# Altium schematic sheet 7c - FET Controls.SchDoc
size A4
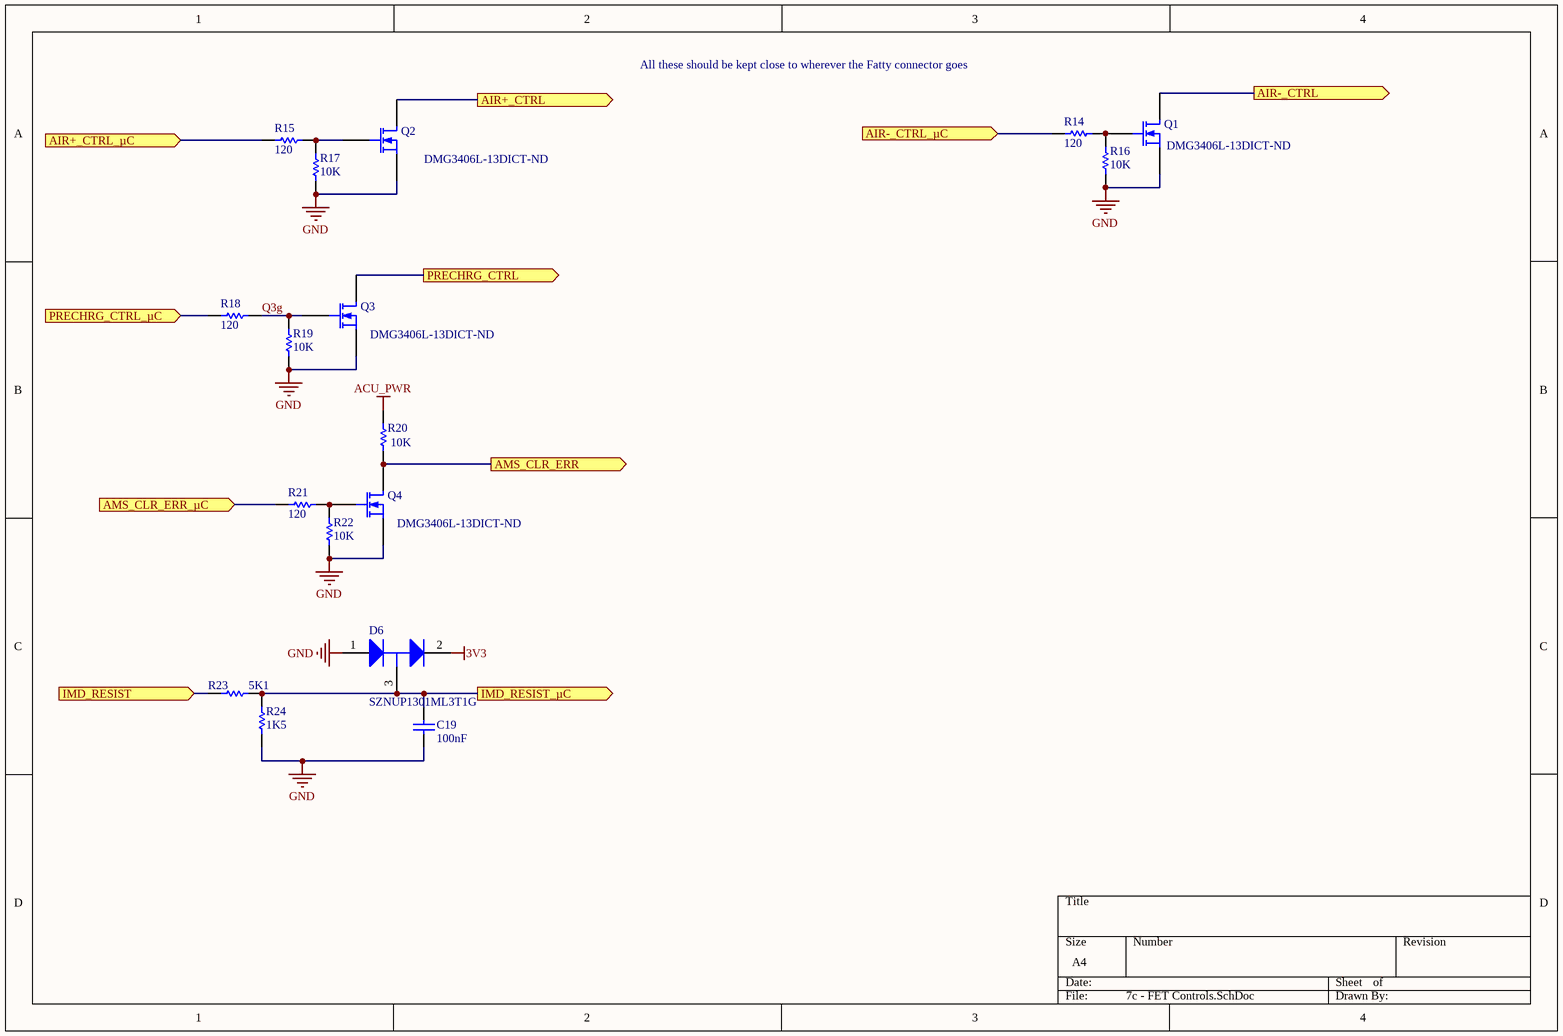
[diagram p0: 7c - FET Controls.SchDoc]

## Parts
C19  value 100nF  [1608[0603]]  (hidden comment: Cap)
D6  SZNUP1301ML3T1G  [ONSC-SOT-23-3-318-08_V]
Q1  Supplier Part Number 1: DMG3406L-13DICT-ND  [SOT-23_N]
Q2  Supplier Part Number 1: DMG3406L-13DICT-ND  [SOT-23_N]
Q3  Supplier Part Number 1: DMG3406L-13DICT-ND  [SOT-23_N]
Q4  Supplier Part Number 1: DMG3406L-13DICT-ND  [SOT-23_N]
R14  120  [1608[0603]]
R15  120  [1608[0603]]
R16  10K  [1608[0603]]
R17  10K  [1608[0603]]
R18  120  [1608[0603]]
R19  10K  [1608[0603]]
R20  10K  [1608[0603]]
R21  120  [1608[0603]]
R22  10K  [1608[0603]]
R23  value 5K1  [1608[0603]]  (hidden comment: Res1)
R24  value 1K5  [1608[0603]]  (hidden comment: Res1)

## Ports
AIR+_CTRL (out), AIR+_CTRL_µC (in), AIR-_CTRL (out), AIR-_CTRL_µC (in), AMS_CLR_ERR (out), AMS_CLR_ERR_µC (in), IMD_RESIST (in), IMD_RESIST_µC (out), PRECHRG_CTRL (out), PRECHRG_CTRL_µC (in)

## Nets
3V3: D6.2(K)
ACU_PWR: R20.2
GND: C19.1 D6.1(A) Q1.2(S) Q2.2(S) Q3.2(S) Q4.2(S) R16.1 R17.1 R19.1 R22.1 R24.1
AIR+_CTRL: Q2.3(D) ; port AIR+_CTRL
AIR+_CTRL_µC: R15.1 ; port AIR+_CTRL_µC
AIR-_CTRL: Q1.3(D) ; port AIR-_CTRL
AIR-_CTRL_µC: R14.1 ; port AIR-_CTRL_µC
AMS_CLR_ERR: Q4.3(D) R20.1 ; port AMS_CLR_ERR
AMS_CLR_ERR_µC: R21.1 ; port AMS_CLR_ERR_µC
IMD_RESIST: R23.1 ; port IMD_RESIST
IMD_RESIST_µC: C19.2 D6.3(K/A) R23.2 R24.2 ; port IMD_RESIST_µC
PRECHRG_CTRL: Q3.3(D) ; port PRECHRG_CTRL
PRECHRG_CTRL_µC: R18.1 ; port PRECHRG_CTRL_µC
Q3g: Q3.1(G) R18.2 R19.2
NetQ1_1: Q1.1(G) R14.2 R16.2
NetQ2_1: Q2.1(G) R15.2 R17.2
NetQ4_1: Q4.1(G) R21.2 R22.2

## Notes on the sheet
- All these should be kept close to wherever the Fatty connector goes

## Library data of the parts
C19 = Cap: Capacitor; Published: 8-Jun-2000; LatestRevisionDate: 17-Jul-2002; LatestRevisionNote: Re-released for DXP Platform.; PackageReference: RAD-0.3; Publisher: Altium Limited; PackageDescription: Radial Cap, Thru-Hole; 2 Leads; 0.3 in Pin Spacing
D6 = CMP-1063-00171-1: Low Capacitance Diode Array for ESD Protection in a Single Data Line, 3-Pin SOT-23, Pb-Free, Tape and Reel; Manufacturer: On Semiconductor; C Max (pF): 0.9; Direction: Bidirectional; V(BR) Min (V): 70; Number of Lines: 1; Mounting Technology: Surface Mount; PackageReference: SOT-23-3-318-08; DatasheetVersion: Rev. 6; PackageVersion: Rev. AP, 11/2009; RoHS: Pb-Free; ComponentLink1Description: Manufacturer URL; ComponentLink1URL: http://www.onsemi.com/; PackageDescription: 3-Pin Small Outline Transistor, Body 2.92 x 1.3 mm, Pitch 0.95 mm; PartNumber: SZNUP1301ML3T1G; Packing: Tape and Reel; ComponentLink3URL: http://www.onsemi.cn/pub_link/Collateral/318-08.PDF; ComponentLink3Description: Package Specification; VRWM Max (V): 70; ComponentLink2Description: Datasheet; ComponentLink2URL: http://www.onsemi.cn/pub_link/Collateral/NUP1301ML3T1-D.PDF
Q1-Q4 = MOSFET-N: N-Channel MOSFET; Manufacturer: Infineon Technologies; Manufacturer Part Number: IPD075N03L G; FET Type: MOSFET N-Channel, Metal Oxide; FET Feature: Logic Level Gate; Drain to Source Voltage (Vdss): 30V; Current - Continuous Drain (Id) @ 25°C: 50A (Tc); Rds On (Max) @ Id, Vgs: 7.5 mOhm @ 30A, 10V; Vgs(th) (Max) @ Id: 2.2V @ 250µA; Gate Charge (Qg) @ Vgs: 18nC @ 10V; Input Capacitance (Ciss) @ Vds: 1900pF @ 15V; Power - Max: 47W; Published: 8-Jun-2000; LatestRevisionDate: 17-Jul-2002; LatestRevisionNote: Re-released for DXP Platform.; PackageVersion: 1995/1996; PackageReference: E3; Publisher: Altium Limited; PackageDescription: TO, Flat Index; 3 In-Line, Axial Leads; Body Dia. 4.6mm; Lead Dia. 0.5 mm (max); RoHS: RoHS Compliant; Category: Discrete Semiconductor Products; Packaging: Cut Tape (CT); Mounting Type: Surface Mount; Package / Case: TO-252-3, DPak (2 Leads + Tab), SC-63; Supplier Device Package: PG-TO252-3; ComponentLink1URL: http://www.infineon.com/dgdl/Infineon-IPD075N03LG-DS-v02_01-en.pdf?folderId=5546d4694909da4801490a07012f053b&fileId=db3a30431936bc4b011951d824f83aeb; ComponentLink1Description: http://www.infineon.com/dgdl/Infineon-IPD075N03LG-DS-v02_01-en.pdf?folderId=5546d4694909da4801490a07012f053b&fileId=db3a30431936bc4b011951d824f83aeb; ComponentLink2URL: http://www.semicon.toshiba.co.jp/info/docget.jsp?type=datasheet&lang=en&pid=SSM3K329R; ComponentLink2Description: http://www.semicon.toshiba.co.jp/info/docget.jsp?type=datasheet&lang=en&pid=SSM3K329R; Supplier 1: Digi-Key
R14-R22 = Res1: Resistor; Value: 1K; Published: 8-Jun-2000; LatestRevisionDate: 17-Jul-2002; LatestRevisionNote: Re-released for DXP Platform.; PackageReference: AXIAL-0.3; Publisher: Altium Limited; PackageDescription: Axial Device, Thru-Hole; 2 Leads; 0.3 in Pin Spacing
R23 R24 = Res1: Resistor; Published: 8-Jun-2000; LatestRevisionDate: 17-Jul-2002; LatestRevisionNote: Re-released for DXP Platform.; PackageReference: AXIAL-0.3; Publisher: Altium Limited; PackageDescription: Axial Device, Thru-Hole; 2 Leads; 0.3 in Pin Spacing